# EAGLE design SNES JAMMA (EAGLE 9.6.2)
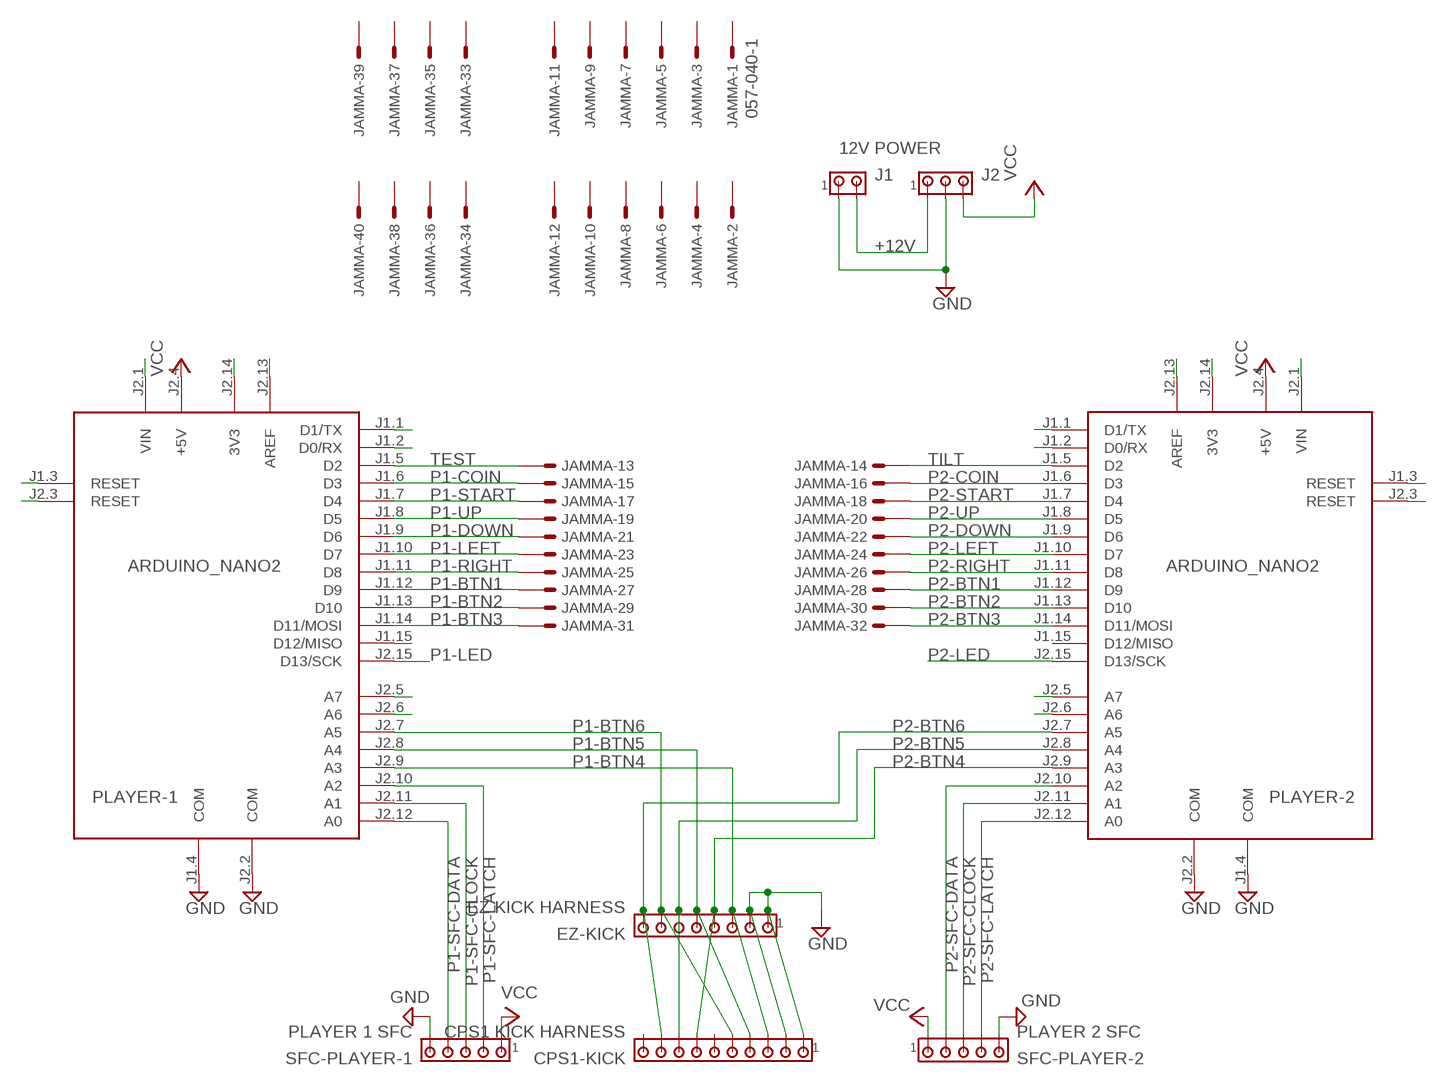
[diagram p0: schematic, sheet 1]

## Parts
CPS1-KICK  CPS1 KICK HARNESS  MTA10-100  [10X10MTA]
EZ-KICK  EZ KICK HARNESS  MTA08-100  [10X08MTA]
J1  12V POWER  MTA02-100  [10X02MTA]
J2  MTA03-100  [10X03MTA]
JAMMA  057-040-1  [057-040-1]
PLAYER-1  ARDUINO_NANO2  [ARDUINO_NANO2]
PLAYER-2  ARDUINO_NANO2  [ARDUINO_NANO2]
SFC-PLAYER-1  PLAYER 1 SFC  MTA05-100  [10X05MTA]
SFC-PLAYER-2  PLAYER 2 SFC  MTA05-100  [10X05MTA]

## Nets
+12V: J1.2 J2.1
GND: CPS1-KICK.1 CPS1-KICK.2 EZ-KICK.1 EZ-KICK.2 J1.1 J2.2 PLAYER-1.J1.4(COM) PLAYER-1.J2.2(COM) PLAYER-2.J1.4(COM) PLAYER-2.J2.2(COM) SFC-PLAYER-1.5 SFC-PLAYER-2.5
N$1: PLAYER-1.J1.3(RESET)
N$2: PLAYER-1.J2.3(RESET)
N$4: PLAYER-1.J1.2(D0/RX)
N$5: PLAYER-1.J1.1(D1/TX)
N$6: PLAYER-1.J1.15(D12/MISO)
N$7: PLAYER-1.J2.5(A7)
N$8: PLAYER-1.J2.6(A6)
N$9: PLAYER-2.J2.6(A6)
N$10: PLAYER-2.J2.5(A7)
N$12: PLAYER-2.J1.2(D0/RX)
N$13: PLAYER-2.J1.1(D1/TX)
N$14: PLAYER-1.J2.1(VIN)
N$15: PLAYER-1.J2.14(3V3)
N$16: PLAYER-1.J2.13(AREF)
N$17: PLAYER-2.J2.1(VIN)
N$18: PLAYER-2.J1.3(RESET)
N$19: PLAYER-2.J2.3(RESET)
N$20: PLAYER-2.J2.14(3V3)
N$21: PLAYER-2.J2.13(AREF)
P1-BTN1: JAMMA.27 PLAYER-1.J1.12(D9)
P1-BTN2: JAMMA.29 PLAYER-1.J1.13(D10)
P1-BTN3: JAMMA.31 PLAYER-1.J1.14(D11/MOSI)
P1-BTN4: CPS1-KICK.3 EZ-KICK.3 PLAYER-1.J2.9(A3)
P1-BTN5: CPS1-KICK.4 EZ-KICK.5 PLAYER-1.J2.8(A4)
P1-BTN6: CPS1-KICK.5 EZ-KICK.7 PLAYER-1.J2.7(A5)
P1-COIN: JAMMA.15 PLAYER-1.J1.6(D3)
P1-DOWN: JAMMA.21 PLAYER-1.J1.9(D6)
P1-LED: PLAYER-1.J2.15(D13/SCK)
P1-LEFT: JAMMA.23 PLAYER-1.J1.10(D7)
P1-RIGHT: JAMMA.25 PLAYER-1.J1.11(D8)
P1-SFC-CLOCK: PLAYER-1.J2.11(A1) SFC-PLAYER-1.3
P1-SFC-DATA: PLAYER-1.J2.12(A0) SFC-PLAYER-1.4
P1-SFC-LATCH: PLAYER-1.J2.10(A2) SFC-PLAYER-1.2
P1-START: JAMMA.17 PLAYER-1.J1.7(D4)
P1-UP: JAMMA.19 PLAYER-1.J1.8(D5)
P2-BTN1: JAMMA.28 PLAYER-2.J1.12(D9)
P2-BTN2: JAMMA.30 PLAYER-2.J1.13(D10)
P2-BTN3: JAMMA.32 PLAYER-2.J1.14(D11/MOSI)
P2-BTN4: CPS1-KICK.7 EZ-KICK.4 PLAYER-2.J2.9(A3)
P2-BTN5: CPS1-KICK.8 EZ-KICK.6 PLAYER-2.J2.8(A4)
P2-BTN6: CPS1-KICK.9 EZ-KICK.8 PLAYER-2.J2.7(A5)
P2-COIN: JAMMA.16 PLAYER-2.J1.6(D3)
P2-DOWN: JAMMA.22 PLAYER-2.J1.9(D6)
P2-LED: PLAYER-2.J2.15(D13/SCK)
P2-LEFT: JAMMA.24 PLAYER-2.J1.10(D7)
P2-RIGHT: JAMMA.26 PLAYER-2.J1.11(D8)
P2-SFC-CLOCK: PLAYER-2.J2.11(A1) SFC-PLAYER-2.3
P2-SFC-DATA: PLAYER-2.J2.12(A0) SFC-PLAYER-2.4
P2-SFC-LATCH: PLAYER-2.J2.10(A2) SFC-PLAYER-2.2
P2-START: JAMMA.18 PLAYER-2.J1.7(D4)
P2-UP: JAMMA.20 PLAYER-2.J1.8(D5)
TEST: JAMMA.13 PLAYER-1.J1.5(D2)
TILT: JAMMA.14 PLAYER-2.J1.5(D2)
VCC: J2.3 PLAYER-1.J2.4(+5V) PLAYER-2.J2.4(+5V) SFC-PLAYER-1.1 SFC-PLAYER-2.1
Unconnected: CPS1-KICK.6 CPS1-KICK.10 JAMMA.1 JAMMA.2 JAMMA.3 JAMMA.4 JAMMA.5 JAMMA.6 JAMMA.7 JAMMA.8 JAMMA.9 JAMMA.10 JAMMA.11 JAMMA.12 JAMMA.33 JAMMA.34 JAMMA.35 JAMMA.36 JAMMA.37 JAMMA.38 JAMMA.39 JAMMA.40 PLAYER-2.J1.15(D12/MISO)

## Library data of the parts
CPS1-KICK = con-amp:MTA10-100: AMP connector
EZ-KICK = con-amp:MTA08-100: AMP connector
J1 = con-amp:MTA02-100: AMP connector
J2 = con-amp:MTA03-100: AMP connector
JAMMA = con-panduit:057-040-: CONNECTOR 40-pin series 057 contact pc board low profile headers; OC_FARNELL: unknown; OC_NEWARK: unknown
PLAYER-1 PLAYER-2 = arduino:ARDUINO_NANO2: Arduino Nano2 Auto generated by modulcreator.ulp \;; ANZAHL: 2; MODUL: TRUE; STECKX0: -76200; STECKX1: 76200; STECKY0: 177800; STECKY1: 177800
SFC-PLAYER-1 SFC-PLAYER-2 = con-amp:MTA05-100: AMP connector

## Board
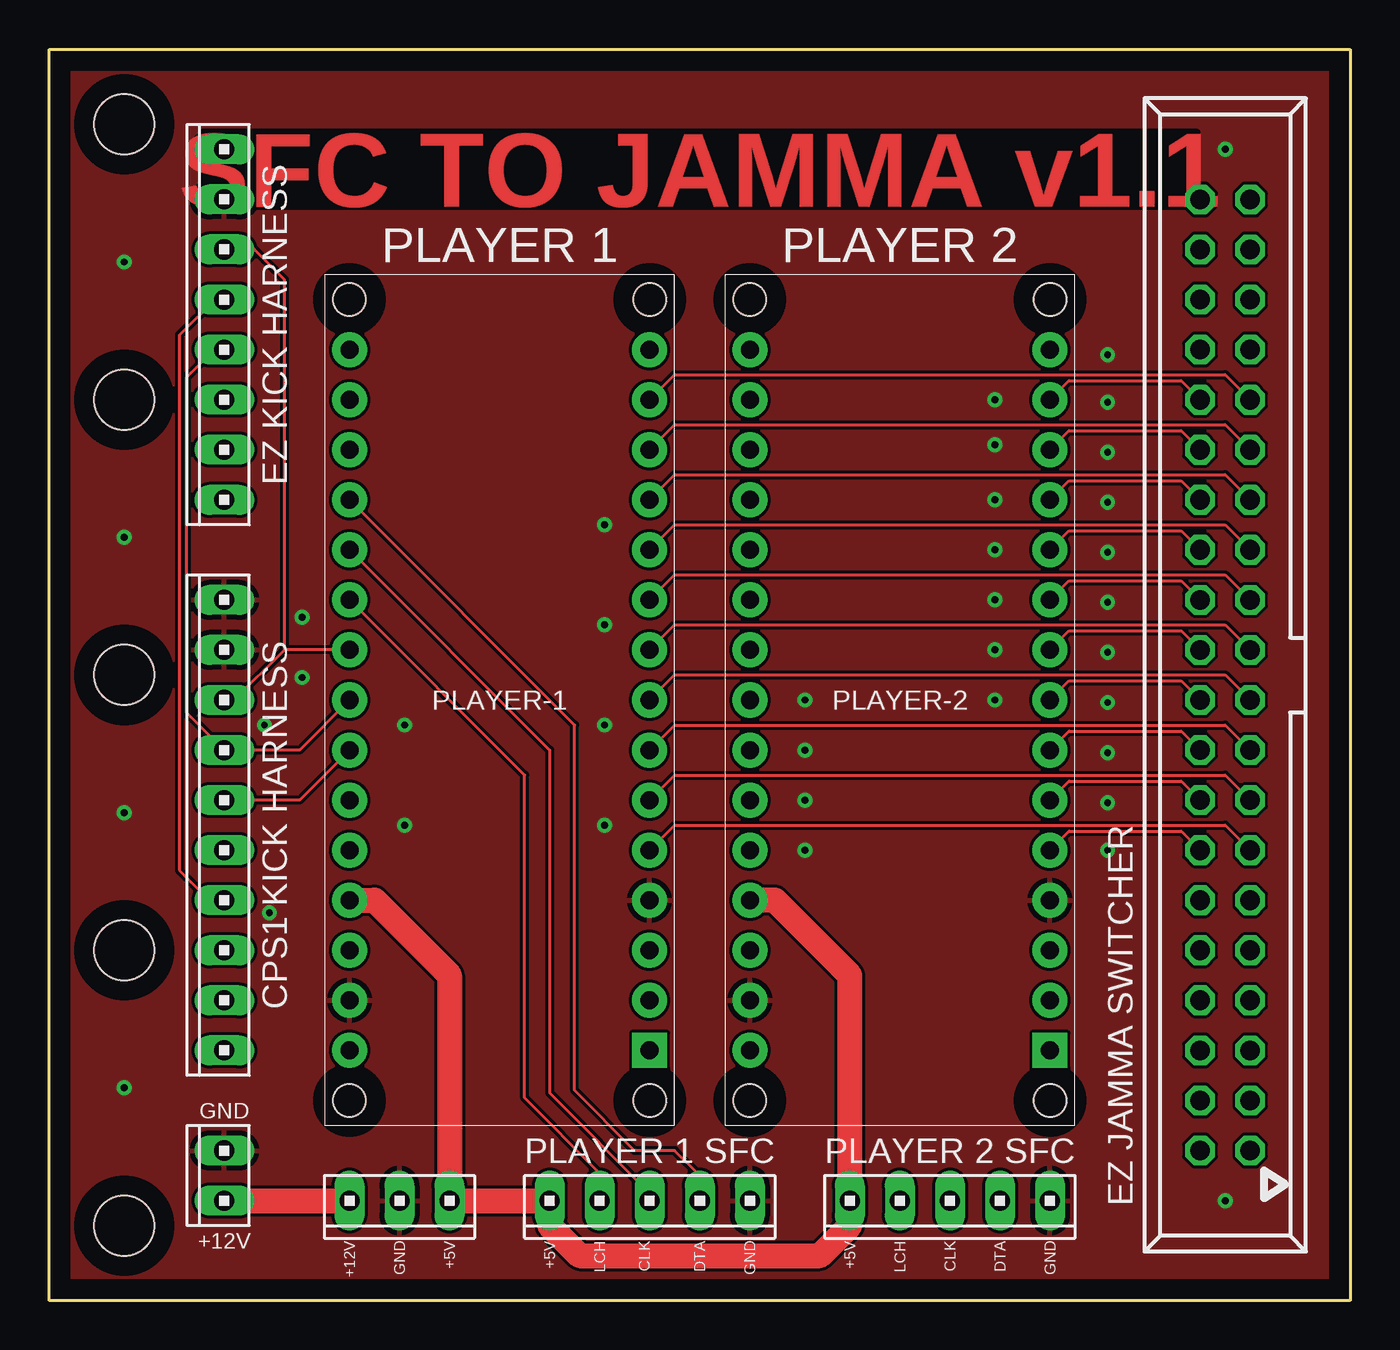
[diagram p1: board, top side]
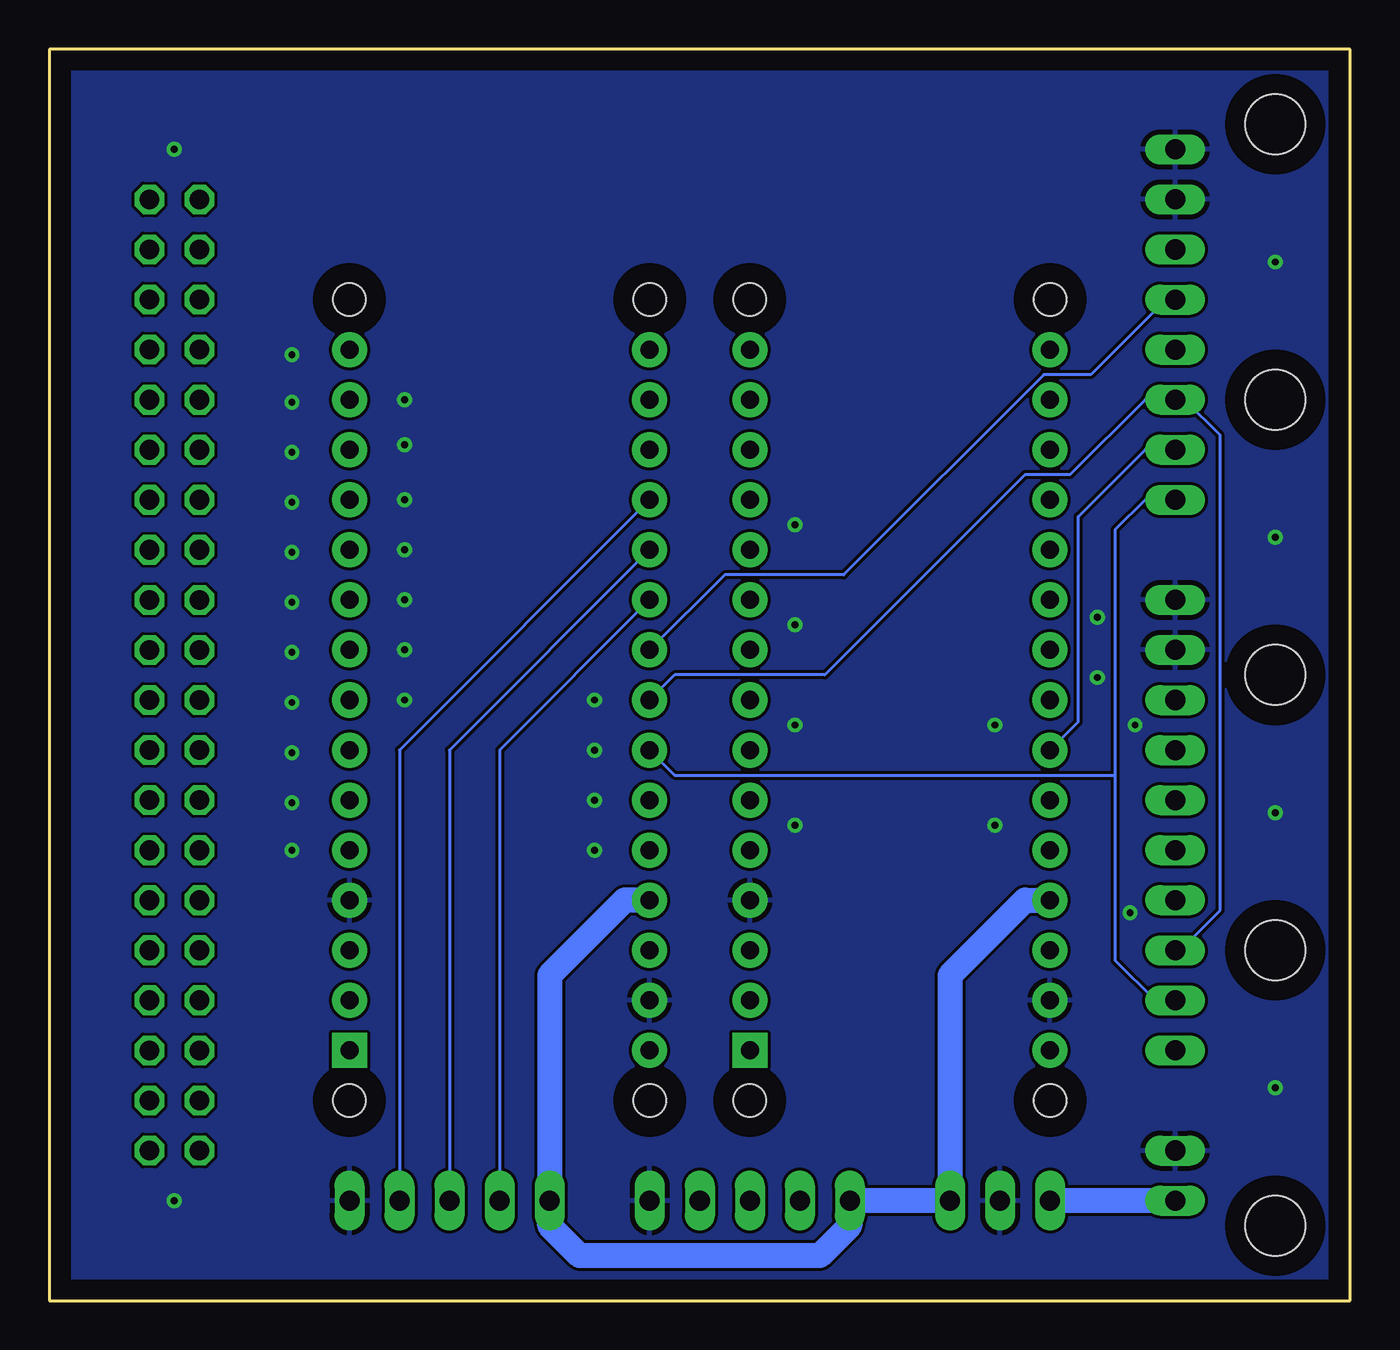
[diagram p2: board, bottom side, seen from below]

Size 66.04 x 63.5 mm. Coordinates in mm from the lower left corner, seen from the top.
Outline: 0,0 0,63.5 66.04,63.5 66.04,0 0,0
Copper layers (1*16): Top 0.035mm / dielectric 1.5mm / Bottom 0.035mm
Design rules "default": minimum track width 6mil, minimum drill 0.35mm, track to track 6mil, track to pad 6mil, pad to pad 6mil, via to via 6mil, smd to smd 6mil, copper to edge 40mil, drill to drill 6mil, minimum pad ring 10mil, minimum via ring 8mil, stop-mask expansion 4mil, vias tented up to drill 0mil, thermal gap 10mil
Holes 3.05 mm at 3.81,3.81 3.81,59.69 3.81,31.75 3.81,45.72 3.81,17.78

### Footprints (pad centres in the part's own frame; a part is rotated, then mirrored left to right if it is on the bottom)
10X10MTA = drill 1.016 long: 1 11.43,0; 2 8.89,0; 3 6.35,0; 4 3.81,0; 5 1.27,0; 6 -1.27,0; 7 -3.81,0; 8 -6.35,0; 9 -8.89,0; 10 -11.43,0
10X08MTA = drill 1.016 long: 1 8.89,0; 2 6.35,0; 3 3.81,0; 4 1.27,0; 5 -1.27,0; 6 -3.81,0; 7 -6.35,0; 8 -8.89,0
10X02MTA = drill 1.016 long: 1 1.27,0; 2 -1.27,0
10X03MTA = drill 1.016 long: 1 2.54,0; 2 0,0; 3 -2.54,0
057-040-1 = drill 1 octagon: 1 -24.13,-1.27; 2 -24.13,1.27; 3 -21.59,-1.27; 4 -21.59,1.27; 5 -19.05,-1.27; 6 -19.05,1.27; 7 -16.51,-1.27; 8 -16.51,1.27; 9 -13.97,-1.27; 10 -13.97,1.27; 11 -11.43,-1.27; 12 -11.43,1.27; 13 -8.89,-1.27; 14 -8.89,1.27; 15 -6.35,-1.27; 16 -6.35,1.27; 17 -3.81,-1.27; 18 -3.81,1.27; 19 -1.27,-1.27; 20 -1.27,1.27; 21 1.27,-1.27; 22 1.27,1.27; 23 3.81,-1.27; 24 3.81,1.27; 25 6.35,-1.27; 26 6.35,1.27; 27 8.89,-1.27; 28 8.89,1.27; 29 11.43,-1.27; 30 11.43,1.27; 31 13.97,-1.27; 32 13.97,1.27; 33 16.51,-1.27; 34 16.51,1.27; 35 19.05,-1.27; 36 19.05,1.27; 37 21.59,-1.27; 38 21.59,1.27; 39 24.13,-1.27; 40 24.13,1.27
ARDUINO_NANO2 = drill 0.914 pad 1.778 square: J1.1 -7.62,17.78 | drill 0.914 pad 1.778: J1.2 -7.62,15.24; J1.3 -7.62,12.7; J1.4 -7.62,10.16; J1.5 -7.62,7.62; J1.6 -7.62,5.08; J1.7 -7.62,2.54; J1.8 -7.62,0; J1.9 -7.62,-2.54; J1.10 -7.62,-5.08; J1.11 -7.62,-7.62; J1.12 -7.62,-10.16; J1.13 -7.62,-12.7; J1.14 -7.62,-15.24; J1.15 -7.62,-17.78; J2.1 7.62,17.78; J2.2 7.62,15.24; J2.3 7.62,12.7; J2.4 7.62,10.16; J2.5 7.62,7.62; J2.6 7.62,5.08; J2.7 7.62,2.54; J2.8 7.62,0; J2.9 7.62,-2.54; J2.10 7.62,-5.08; J2.11 7.62,-7.62; J2.12 7.62,-10.16; J2.13 7.62,-12.7; J2.14 7.62,-15.24; J2.15 7.62,-17.78 | hole 1.651: -7.62,-20.32; 7.62,-20.32; 7.62,20.32; -7.62,20.32
10X05MTA = drill 1.016 long: 1 5.08,0; 2 2.54,0; 3 0,0; 4 -2.54,0; 5 -5.08,0

### Placement (x,y rotation side)
CPS1-KICK  8.89,24.13 90 top
EZ-KICK  8.89,49.53 90 top
J1  8.89,6.35 90 top
J2  17.78,5.08 180 top
JAMMA  59.69,31.75 90 top
PLAYER-1  22.86,30.48 180 top
PLAYER-2  43.18,30.48 180 top
SFC-PLAYER-1  30.48,5.08 180 top
SFC-PLAYER-2  45.72,5.08 180 top

### Tracks (layer width: path | path; a pad name or v marks a point on that pad's centre or on a via)
+12V
  Top 1.27: J1.2 J2.1
  Bottom 1.27: J1.2 J2.1
GND  (via drill 0.35)
  other vias: 28.19,34.29 48.01,45.72 48.01,43.43 48.01,40.64 48.01,38.1 48.01,35.56 48.01,33.02 48.01,30.48 38.35,30.48 38.35,27.94 28.19,39.37 3.81,10.79 3.81,24.77 3.81,38.73 3.81,52.7 53.72,25.27 53.72,27.81 53.72,30.35 53.72,32.89 53.72,35.43 53.72,37.97 53.72,40.51 53.72,43.05 53.72,45.59 53.72,48.01 18.03,29.21 12.83,34.67 12.83,31.62 10.92,29.21 11.18,19.68 18.03,24.13 38.35,25.4 59.69,5.08 59.69,58.42 28.19,29.21 28.19,24.13 38.35,22.86 53.72,22.86
  pour Bottom: 0,63.5 66.04,63.5 66.04,0 0,0
  pour Top: 0,63.5 66.04,63.5 66.04,0 0,0
P1-BTN1
  Top 0.152: JAMMA.27 59.69,41.91 31.75,41.91 PLAYER-1.J1.12
P1-BTN2
  Top 0.152: JAMMA.29 59.69,44.45 31.75,44.45 PLAYER-1.J1.13
P1-BTN3
  Top 0.152: JAMMA.31 59.69,46.99 31.75,46.99 PLAYER-1.J1.14
P1-BTN4
  Top 0.152: EZ-KICK.3 10.41,53.34 11.94,51.82 11.94,33.02 | 11.94,33.02 9.4,30.48 CPS1-KICK.3 | PLAYER-1.J2.9 11.94,33.02
P1-BTN5
  Top 0.152: EZ-KICK.5 8.38,48.26 6.99,46.86 6.99,29.84 CPS1-KICK.4 12.7,27.94 PLAYER-1.J2.8
P1-BTN6
  Top 0.152: CPS1-KICK.5 12.7,25.4 PLAYER-1.J2.7
  Bottom 0.152: PLAYER-1.J2.7 13.81,29.37 13.81,39.78 10.41,43.18 EZ-KICK.7
P1-COIN
  Top 0.152: PLAYER-1.J1.6 31.75,26.67 59.69,26.67 JAMMA.15
P1-DOWN
  Top 0.152: JAMMA.21 59.69,34.29 31.75,34.29 PLAYER-1.J1.9
P1-LEFT
  Top 0.152: JAMMA.23 59.69,36.83 31.75,36.83 PLAYER-1.J1.10
P1-RIGHT
  Top 0.152: JAMMA.25 59.69,39.37 31.75,39.37 PLAYER-1.J1.11
P1-SFC-CLOCK
  Top 0.152: PLAYER-1.J2.11 25.4,27.94 25.4,10.54 30.48,5.46 SFC-PLAYER-1.3
P1-SFC-DATA
  Top 0.152: SFC-PLAYER-1.4 33.02,6.35 31.75,7.62 29.72,7.62 26.67,10.67 26.67,29.21 PLAYER-1.J2.12
P1-SFC-LATCH
  Top 0.152: PLAYER-1.J2.10 24.13,26.67 24.13,10.29 27.94,6.48 SFC-PLAYER-1.2
P1-START
  Top 0.152: PLAYER-1.J1.7 31.75,29.21 59.69,29.21 JAMMA.17
P1-UP
  Top 0.152: JAMMA.19 59.69,31.75 31.75,31.75 PLAYER-1.J1.8
P2-BTN1
  Top 0.152: PLAYER-2.J1.12 51.77,41.6 57.45,41.6 JAMMA.28
P2-BTN2
  Top 0.152: PLAYER-2.J1.13 51.77,44.15 57.45,44.15 JAMMA.30
P2-BTN3
  Top 0.152: PLAYER-2.J1.14 51.77,46.69 57.45,46.69 JAMMA.32
P2-BTN4
  Top 0.152: EZ-KICK.4 8.41,50.8 6.6,48.99 6.6,21.84 8.13,20.32 CPS1-KICK.7
  Bottom 0.152: EZ-KICK.4 9.37,50.8 13.18,46.99 15.56,46.99 25.72,36.83 31.75,36.83 PLAYER-2.J2.9
P2-BTN5
  Bottom 0.152: PLAYER-2.J2.8 34.29,31.75 26.67,31.75 16.51,41.91 14.22,41.91 10.41,45.72 EZ-KICK.6 8.41,45.72 6.6,43.91 6.6,19.81 8.64,17.78 CPS1-KICK.8
P2-BTN6
  Bottom 0.152: CPS1-KICK.9 9.91,15.24 11.94,17.27 11.94,26.67 | PLAYER-2.J2.7 34.29,26.67 11.94,26.67 | EZ-KICK.8 10.41,40.64 11.94,39.12 11.94,26.67
P2-COIN
  Top 0.152: PLAYER-2.J1.6 51.77,26.36 57.45,26.36 JAMMA.16
P2-DOWN
  Top 0.152: PLAYER-2.J1.9 51.77,33.98 57.45,33.98 JAMMA.22
P2-LEFT
  Top 0.152: PLAYER-2.J1.10 51.77,36.52 57.45,36.52 JAMMA.24
P2-RIGHT
  Top 0.152: PLAYER-2.J1.11 51.77,39.06 57.45,39.06 JAMMA.26
P2-SFC-CLOCK
  Bottom 0.152: SFC-PLAYER-2.3 45.72,27.94 PLAYER-2.J2.11
P2-SFC-DATA
  Bottom 0.152: SFC-PLAYER-2.4 48.26,27.94 PLAYER-2.J2.12
P2-SFC-LATCH
  Bottom 0.152: SFC-PLAYER-2.2 43.18,27.94 PLAYER-2.J2.10
P2-START
  Top 0.152: PLAYER-2.J1.7 51.77,28.91 57.45,28.91 JAMMA.18
P2-UP
  Top 0.152: PLAYER-2.J1.8 51.77,31.45 57.45,31.45 JAMMA.20
TEST
  Top 0.152: PLAYER-1.J1.5 31.75,24.13 59.69,24.13 JAMMA.13
TILT
  Top 0.152: PLAYER-2.J1.5 51.77,23.82 57.45,23.82 JAMMA.14
VCC
  Top 1.27: PLAYER-1.J2.4 16.51,20.32 20.32,16.51 J2.3 SFC-PLAYER-1.1 25.4,3.81 26.92,2.29 39.12,2.29 40.64,3.81 SFC-PLAYER-2.1 40.64,16.51 36.83,20.32 PLAYER-2.J2.4
  Bottom 1.27: PLAYER-1.J2.4 16.51,20.32 20.32,16.51 J2.3 SFC-PLAYER-1.1 25.4,3.81 26.92,2.29 39.12,2.29 40.64,3.81 SFC-PLAYER-2.1 40.64,16.51 36.83,20.32 PLAYER-2.J2.4

### Text on the board
Top: SFC TO JAMMA v1.1
tNames: PLAYER 1 | PLAYER 2 | EZ JAMMA SWITCHER | GND | +12V | +12V | GND | +5V | +5V | LCH | CLK | DTA | GND | +5V | LCH | CLK | DTA | GND